# Altium project eGAN-FET-module.PrjPcb
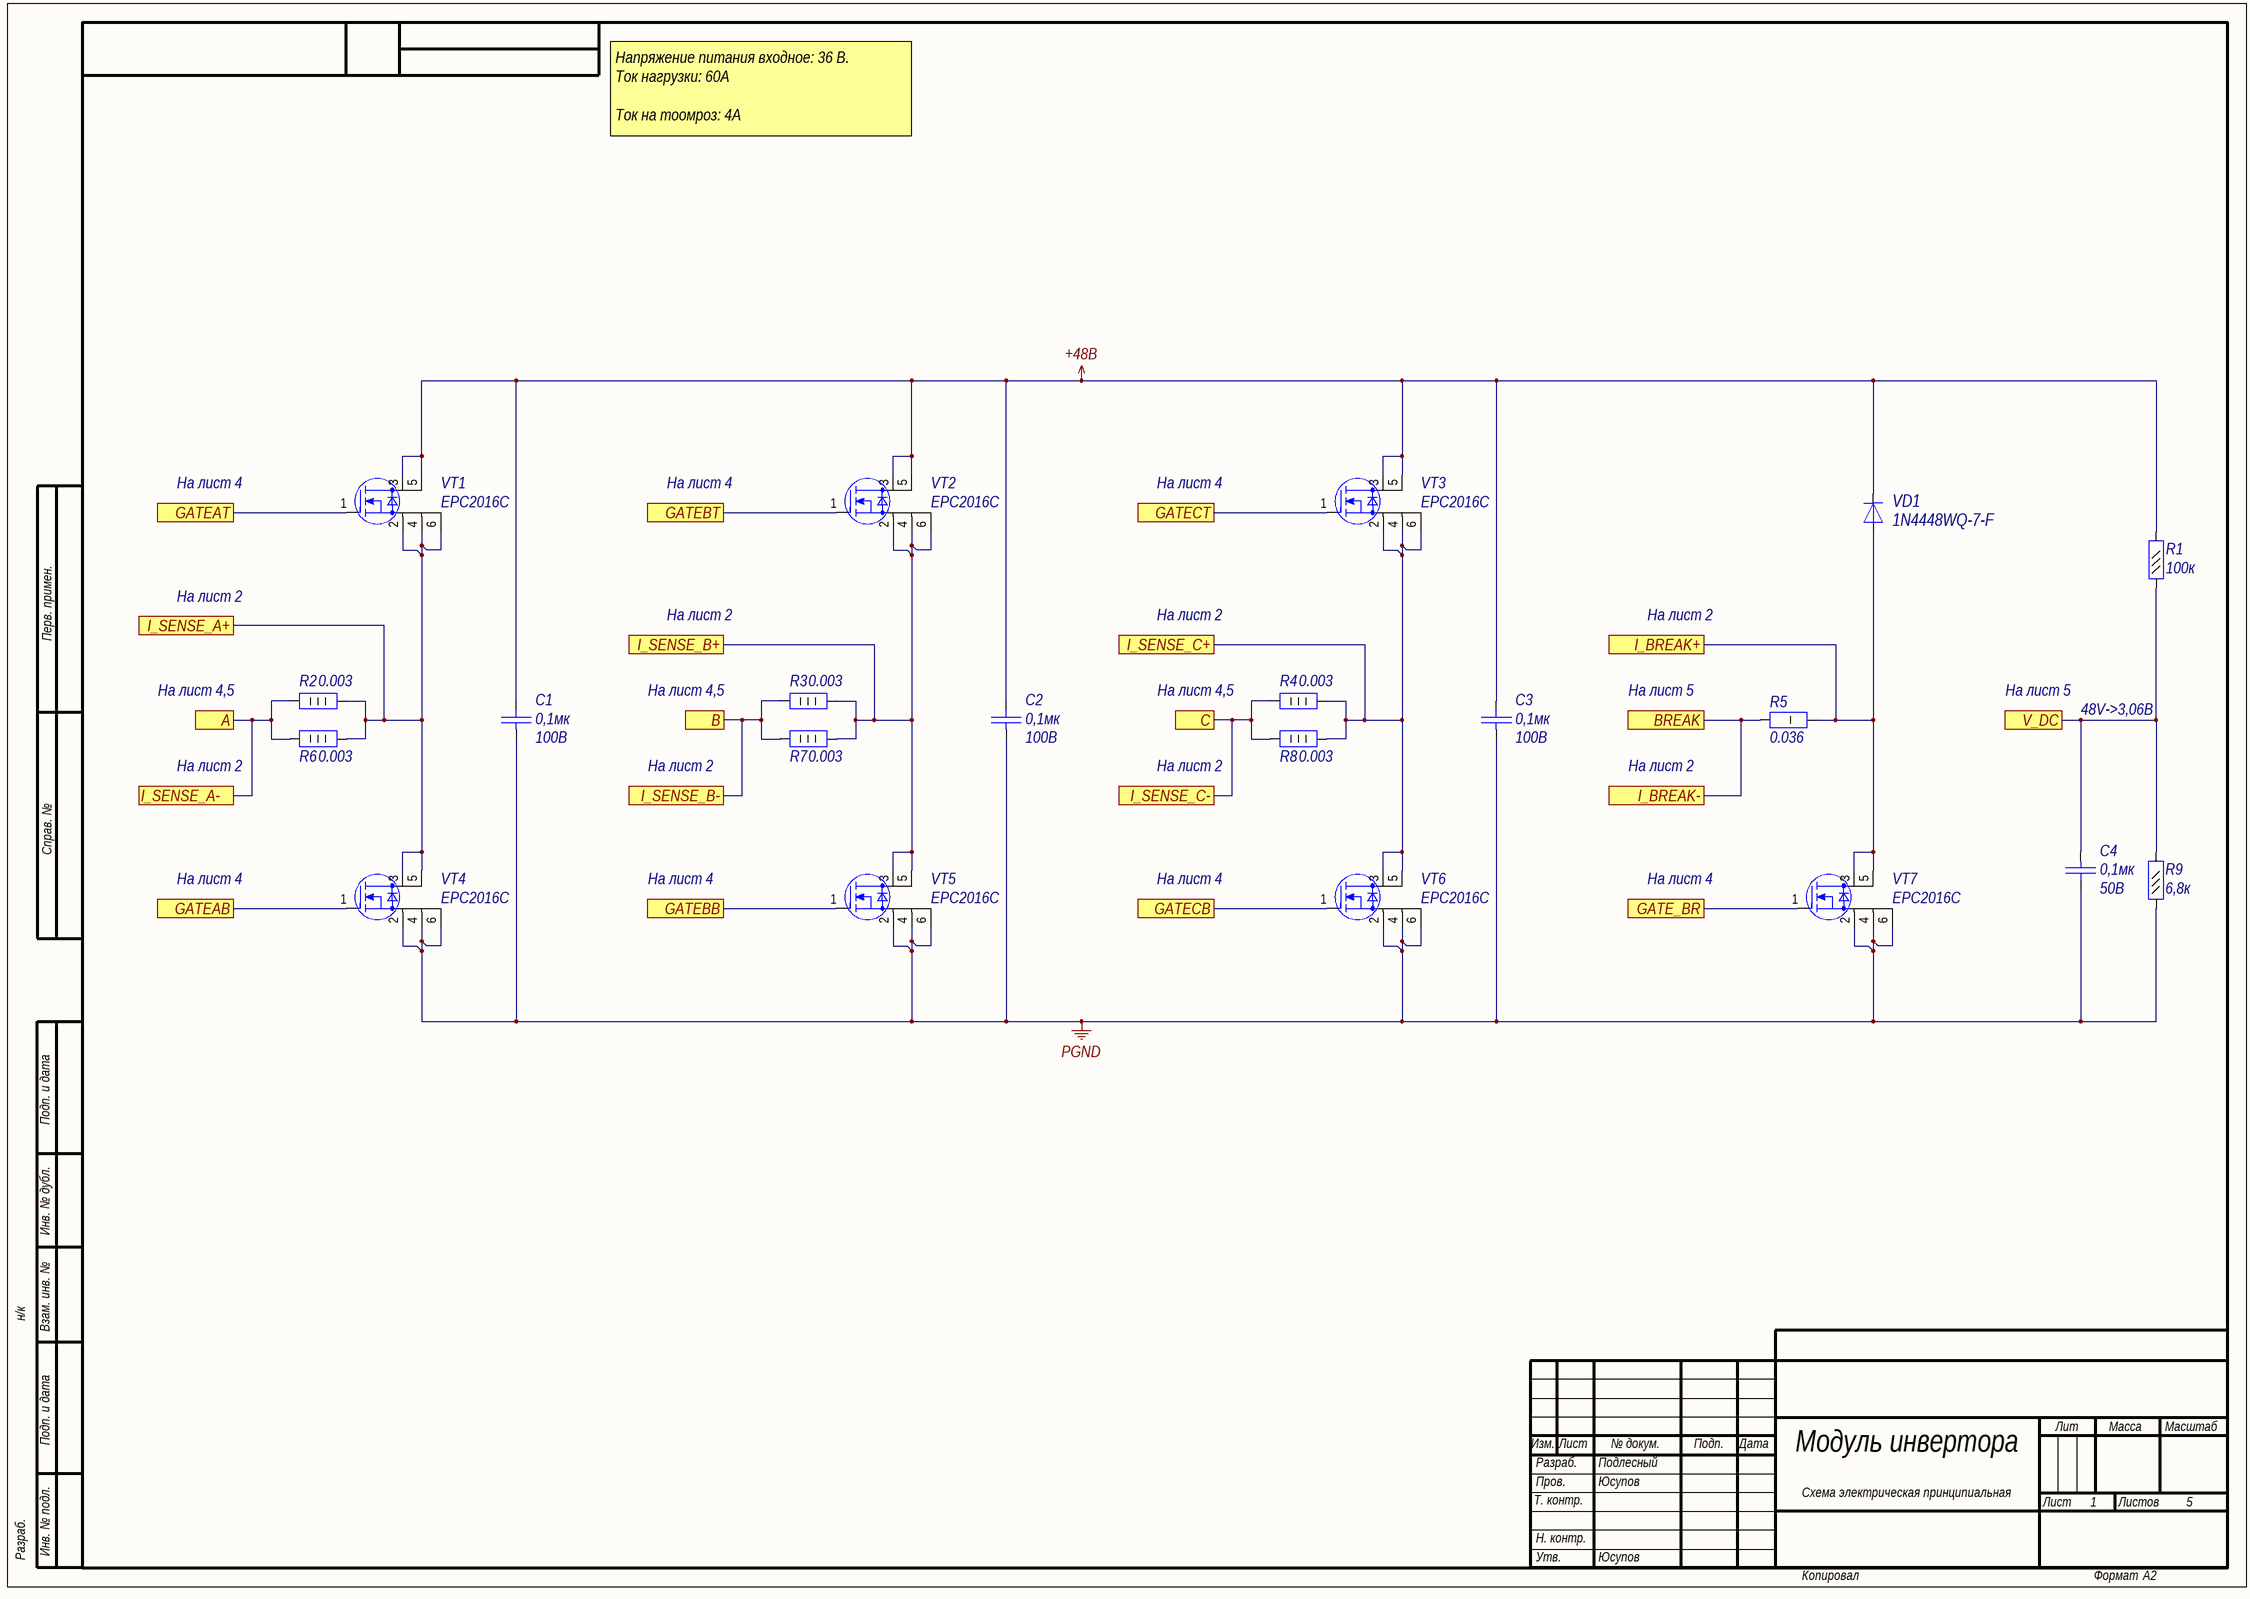
[diagram p0: eGAN-FET-module_Bridge.SchDoc]
5 sheets, 138 parts. Net scope: flat (ports and power ports of the same name join across sheets).
Board file: eGAN-FET-module.PcbDoc
Sheets:
  eGAN-FET-module_Bridge.SchDoc
  eGAN-FET-module_Amplifier.SchDoc
  eGAN-FET-module_Logic.SchDoc
  eGAN-FET-module_Driver.SchDoc
  eGAN-FET-module_Connectors.SchDoc

## Sheet eGAN-FET-module_Bridge.SchDoc: Модуль инвертора
size 594 x 420 mm; ApprovedBy: Юсупов; CheckedBy: Юсупов; DrawnBy: Подлесный; SheetNumber: 1; SheetTotal: 5; Format: A2; DocumentType: Схема электрическая принципиальная

### Parts
C1  Voltage: 100В  [C1206]  (hidden comment: 0,1мк)
C2  Voltage: 100В  [C1206]  (hidden comment: 0,1мк)
C3  Voltage: 100В  [C1206]  (hidden comment: 0,1мк)
C4  value 0,1мк  Voltage: 50В  [C0402]  (hidden comment: Capacitor)
R1  value 100к  [R0402]  (hidden comment: Resistor_0,062Вт)
R2  0.003  [R2512]
R3  0.003  [R2512]
R4  0.003  [R2512]
R5  0.036  [R1206]
R6  0.003  [R2512]
R7  0.003  [R2512]
R8  0.003  [R2512]
R9  6,8к  [R0402]
VD1  1N4448WQ-7-F  [SOD-123]
VT1  EPC2016C  [EPC2016C]
VT2  EPC2016C  [EPC2016C]
VT3  EPC2016C  [EPC2016C]
VT4  EPC2016C  [EPC2016C]
VT5  EPC2016C  [EPC2016C]
VT6  EPC2016C  [EPC2016C]
VT7  EPC2016C  [EPC2016C]

### Ports
A, B, BREAK, C, GATE_BR, GATEAB, GATEAT, GATEBB, GATEBT, GATECB, GATECT, I_BREAK+, I_BREAK-, I_SENSE_A+, I_SENSE_A-, I_SENSE_B+, I_SENSE_B-, I_SENSE_C+, I_SENSE_C-, V_DC

### Nets
+48B: C1.2 C2.2 C3.2 R1.2 VD1.1(K) VT1.3(D) VT1.5(D) VT2.3(D) VT2.5(D) VT3.3(D) VT3.5(D)
PGND: C1.1 C2.1 C3.1 C4.2 R9.1 VT4.2(SUBSTRATE) VT4.4(S) VT4.6(S) VT5.2(SUBSTRATE) VT5.4(S) VT5.6(S) VT6.2(SUBSTRATE) VT6.4(S) VT6.6(S) VT7.2(SUBSTRATE) VT7.4(S) VT7.6(S)
A: R2.1 R6.1 ; port A, port I_SENSE_A-
B: R3.1 R7.1 ; port B, port I_SENSE_B-
BREAK: R5.1 ; port BREAK, port I_BREAK-
C: R4.1 R8.1 ; port C, port I_SENSE_C-
GATE_BR: VT7.1(G) ; port GATE_BR
GATEAB: VT4.1(G) ; port GATEAB
GATEAT: VT1.1(G) ; port GATEAT
GATEBB: VT5.1(G) ; port GATEBB
GATEBT: VT2.1(G) ; port GATEBT
GATECB: VT6.1(G) ; port GATECB
GATECT: VT3.1(G) ; port GATECT
I_BREAK+: R5.2 VD1.2(A) VT7.3(D) VT7.5(D) ; port I_BREAK+
I_SENSE_A+: R2.2 R6.2 VT1.2(SUBSTRATE) VT1.4(S) VT1.6(S) VT4.3(D) VT4.5(D) ; port I_SENSE_A+
I_SENSE_B+: R3.2 R7.2 VT2.2(SUBSTRATE) VT2.4(S) VT2.6(S) VT5.3(D) VT5.5(D) ; port I_SENSE_B+
I_SENSE_C+: R4.2 R8.2 VT3.2(SUBSTRATE) VT3.4(S) VT3.6(S) VT6.3(D) VT6.5(D) ; port I_SENSE_C+
V_DC: C4.1 R1.1 R9.2 ; port V_DC

### Notes on the sheet
- Напряжение питания входное: 36 B.
  Ток нагрузки: 60А
  Ток на тоомроз: 4А
- На лист 4
- Перв. примен.
- На лист 2
- На лист 4,5
- (near R4) На лист 4,5
- На лист 5
- 48V->3,06B
- Справ. №
- Подп. и дата
- Инв. № дубл.
- н/к
- Взам. инв. №
- Изм.
- Лист
- № докум.
- Подп.
- Дата
- Лит
- Масса
- Масштаб
- Т. контр.
- Пров.
- Разраб.
- Листов
- Инв. № подл.
- Н. контр.
- Утв.
- Копировал
- Формат

### Library data of the parts
C1-C3 = cap286: Конденсатор; Part Name: Ceramic; Manufacture: Murata; Part Number: GRM31C5C2A104JA01L; id: cap286; TKE: NP0; Value: 0,1мк
C4 = cap277: Конденсатор; Part Name: Ceramic; Manufacture: Murata; Part Number: GRM155R71H104KE14D; id: cap277; TKE: X7R; tga: 0,10%
R1 = res318: Резистор; Manufacture: Yageo; Part Number: RC0402FR-07100KL; id: res318; Accuracy: 0.01; Part Name: Resistor; Power: 0,062Вт
R2-R4 R6-R8 = CRE2512-FZ-R003E-3: Резистор; Part Name: Current Sense Resistors; Manufacture: Bourns; id: shunt11; Accuracy: 0.01; Power: 3Вт; Part Number: CRE2512-FZ-R003E-3; Value: 0.003
R5 = ERJ-8CWFR036V: Резистор; Part Name: Current Sense Resistors; id: shunt12; Accuracy: 0.01; Power: 1Вт; Part Number: ERJ-8CWFR036V; Value: 0.036
R9 = res290: Резистор; Part Name: Resistor; Manufacture: Yageo; Part Number: RC0402FR-076K8; id: res290; Accuracy: 0.01; Power: 0,062Вт; Value: 6,8к
VD1 = diode45: Диод; Part Name: General Purpose Diodes; Manufacture: Diodes Incorporated; Max Reverse Voltage: 100B; Forward Voltage: 1,25B; Forward Current: 4A; Reverse Current: 2,5uA; Reverse Recovery time: 4ns; Capacitance: 4pF; Number: 1; id: diode45; Temp MAX: +150; Temp MIN: -65; Part Number: 1N4448WQ-7-F
VT1-VT7 = mosfert39: eGaN Enhancement Mode Power Transistor; Manufacturer: EPC; Structure: n-channel; V drain-source max: 100B; Rds: 0,016Ohm; Gate-to-source voltage: (+)6/-4; Continuous drain current: 18A; Total gate charge: 4,5nC; Pulsed drain current: 75A; id: mosfert39; Part Number: EPC2016C

## Sheet eGAN-FET-module_Amplifier.SchDoc
size 594 x 420 mm; SheetNumber: 2; Format: A2
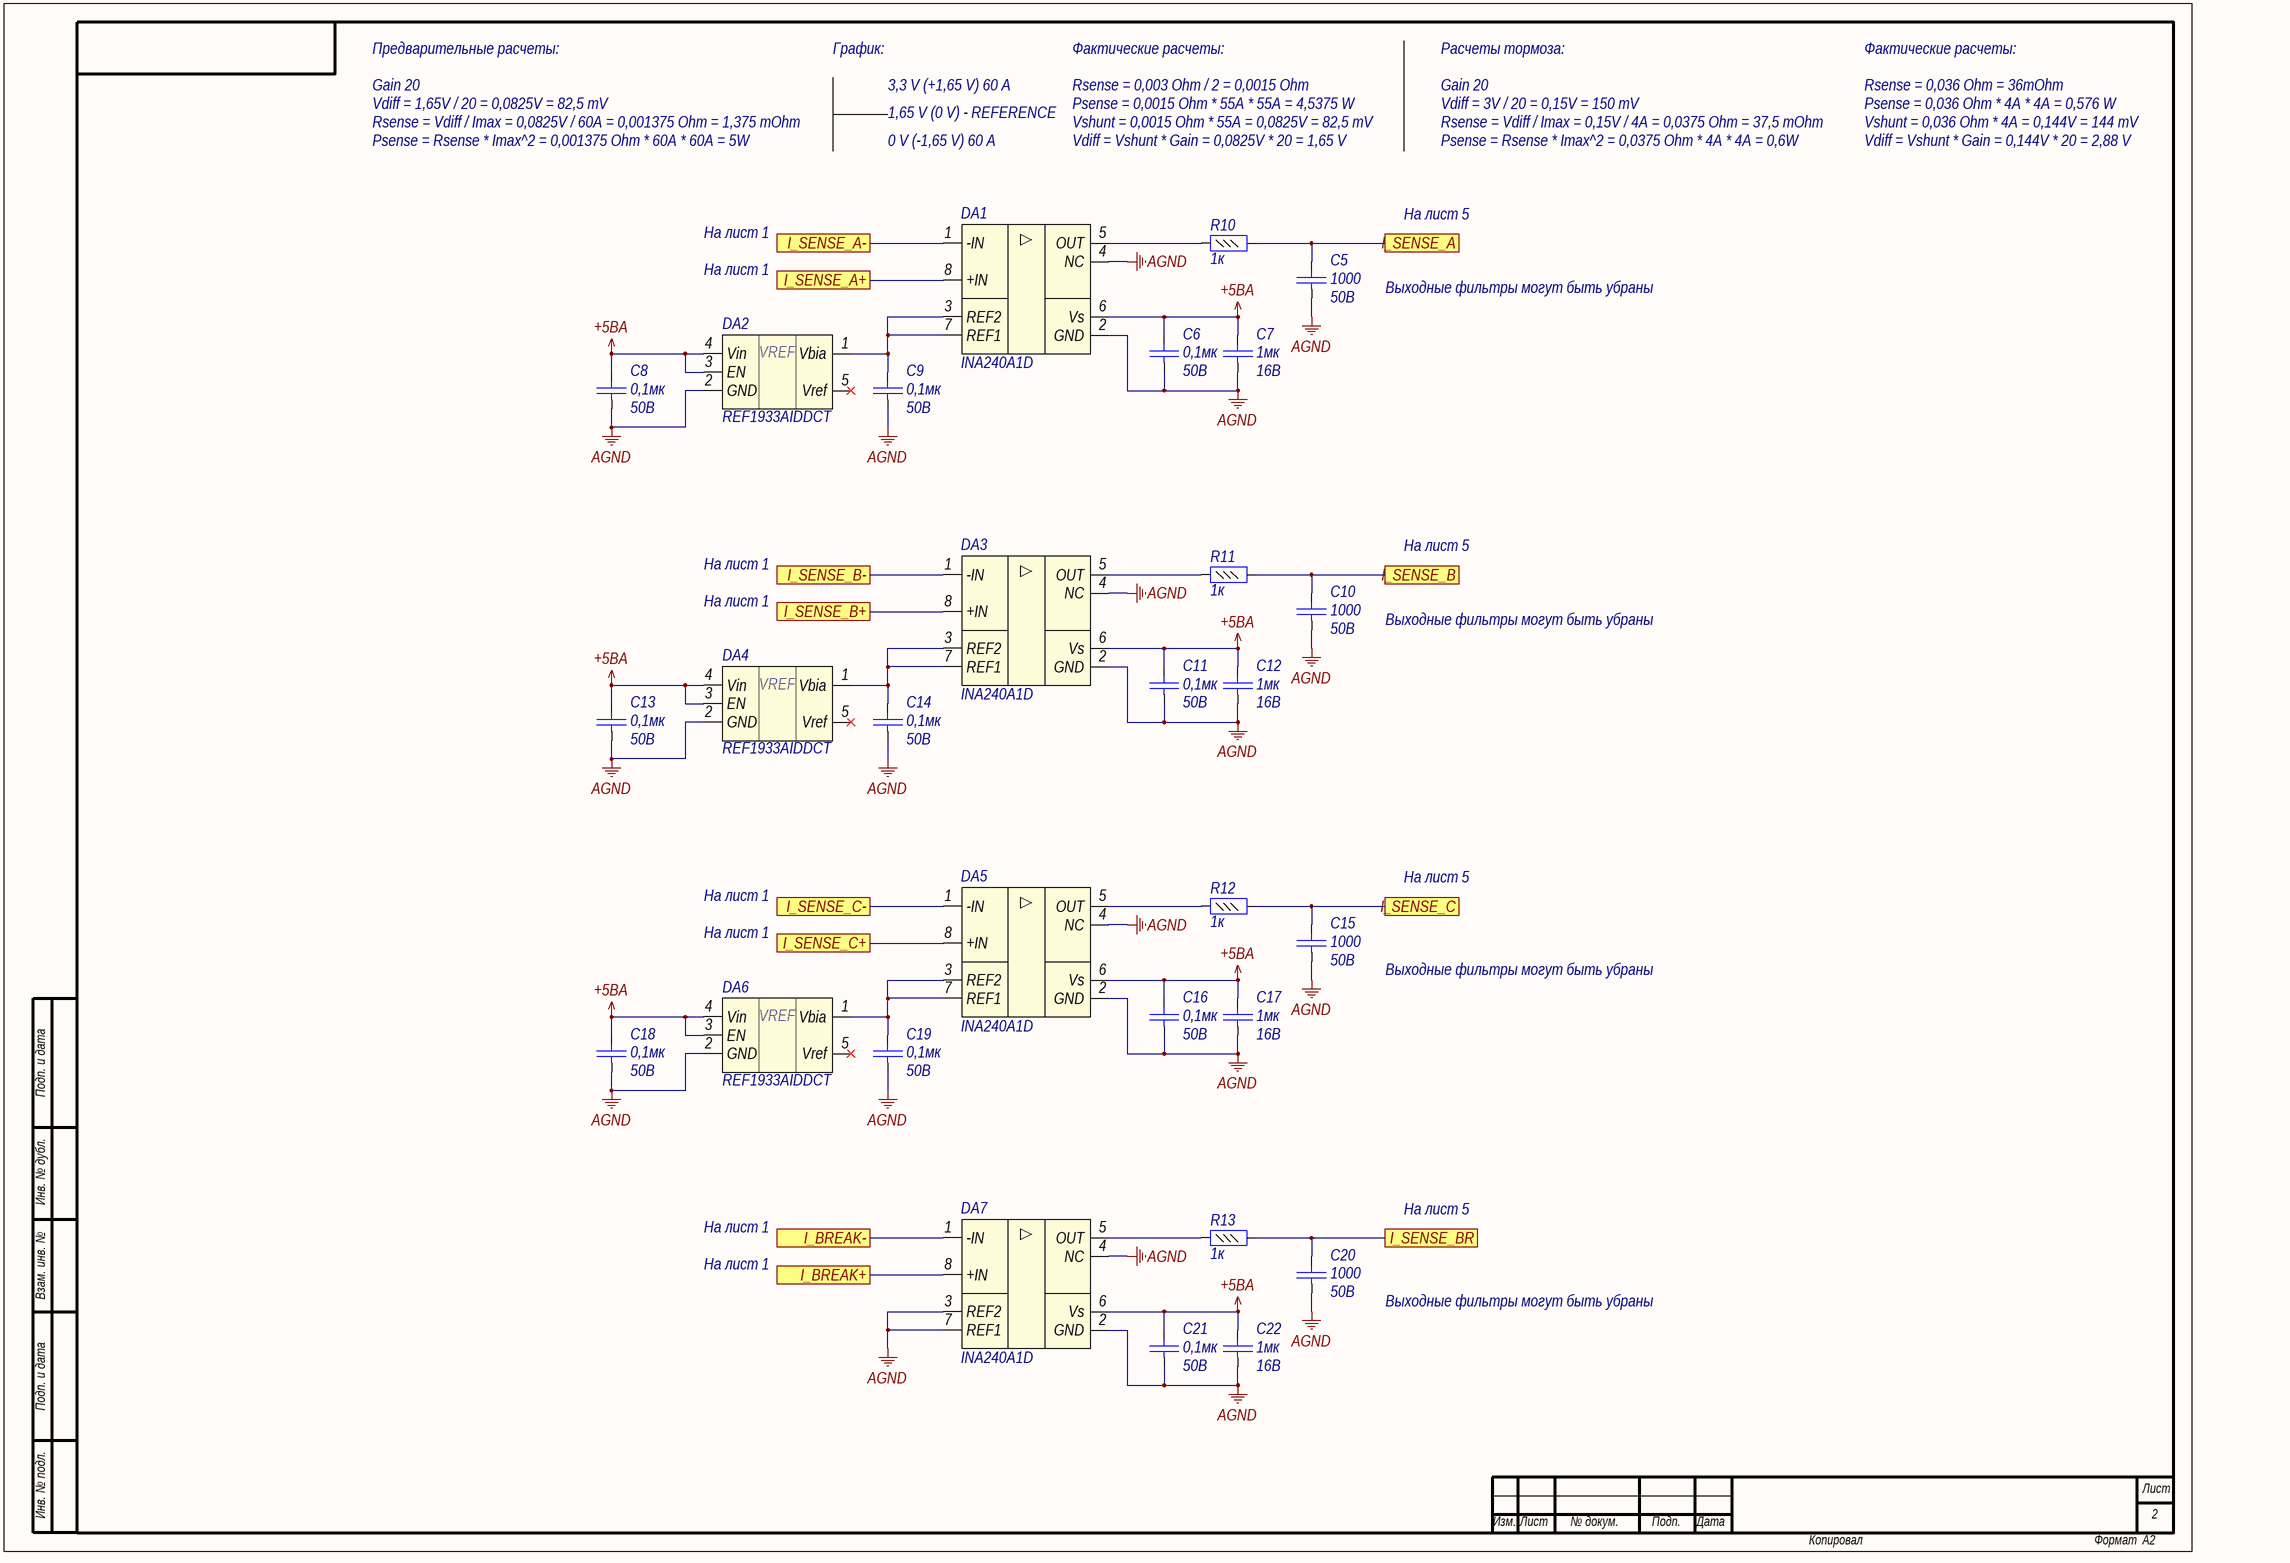
[diagram p1: eGAN-FET-module_Amplifier.SchDoc]

### Parts
C5  value 1000  Voltage: 50B  [C0402]  (hidden comment: Capacitor)
C6  value 0,1мк  Voltage: 50В  [C0402]  (hidden comment: Capacitor)
C7  Voltage: 16B  [C0402]  (hidden comment: 1мк)
C8  value 0,1мк  Voltage: 50В  [C0402]  (hidden comment: Capacitor)
C9  value 0,1мк  Voltage: 50В  [C0402]  (hidden comment: Capacitor)
C10  value 1000  Voltage: 50B  [C0402]  (hidden comment: Capacitor)
C11  value 0,1мк  Voltage: 50В  [C0402]  (hidden comment: Capacitor)
C12  Voltage: 16B  [C0402]  (hidden comment: 1мк)
C13  value 0,1мк  Voltage: 50В  [C0402]  (hidden comment: Capacitor)
C14  value 0,1мк  Voltage: 50В  [C0402]  (hidden comment: Capacitor)
C15  value 1000  Voltage: 50B  [C0402]  (hidden comment: Capacitor)
C16  value 0,1мк  Voltage: 50В  [C0402]  (hidden comment: Capacitor)
C17  Voltage: 16B  [C0402]  (hidden comment: 1мк)
C18  value 0,1мк  Voltage: 50В  [C0402]  (hidden comment: Capacitor)
C19  value 0,1мк  Voltage: 50В  [C0402]  (hidden comment: Capacitor)
C20  value 1000  Voltage: 50B  [C0402]  (hidden comment: Capacitor)
C21  value 0,1мк  Voltage: 50В  [C0402]  (hidden comment: Capacitor)
C22  Voltage: 16B  [C0402]  (hidden comment: 1мк)
DA1  INA240A1D  [SO8]
DA2  REF1933AIDDCT  [SOT23-5]
DA3  INA240A1D  [SO8]
DA4  REF1933AIDDCT  [SOT23-5]
DA5  INA240A1D  [SO8]
DA6  REF1933AIDDCT  [SOT23-5]
DA7  INA240A1D  [SO8]
R10  value 1к  [R0402]  (hidden comment: Resistor_0,062Вт)
R11  value 1к  [R0402]  (hidden comment: Resistor_0,062Вт)
R12  value 1к  [R0402]  (hidden comment: Resistor_0,062Вт)
R13  value 1к  [R0402]  (hidden comment: Resistor_0,062Вт)

### Ports
I_BREAK+, I_BREAK-, I_SENSE_A, I_SENSE_A+, I_SENSE_A-, I_SENSE_B, I_SENSE_B+, I_SENSE_B-, I_SENSE_BR, I_SENSE_C, I_SENSE_C+, I_SENSE_C-

### Nets
+5BA: C6.2 C7.2 C8.2 C11.2 C12.2 C13.2 C16.2 C17.2 C18.2 C21.2 C22.2 DA1.6(Vs) DA2.3(EN) DA2.4(Vin) DA3.6(Vs) DA4.3(EN) DA4.4(Vin) DA5.6(Vs) DA6.3(EN) DA6.4(Vin) DA7.6(Vs)
AGND: C5.1 C6.1 C7.1 C8.1 C9.1 C10.1 C11.1 C12.1 C13.1 C14.1 C15.1 C16.1 C17.1 C18.1 C19.1 C20.1 C21.1 C22.1 DA1.2(GND) DA1.4(NC) DA2.2(GND) DA3.2(GND) DA3.4(NC) DA4.2(GND) DA5.2(GND) DA5.4(NC) DA6.2(GND) DA7.2(GND) DA7.3(REF2) DA7.4(NC) DA7.7(REF1)
A: DA1.1(-IN) ; port I_SENSE_A-
B: DA3.1(-IN) ; port I_SENSE_B-
BREAK: DA7.1(-IN) ; port I_BREAK-
C: DA5.1(-IN) ; port I_SENSE_C-
I_BREAK+: DA7.8(+IN) ; port I_BREAK+
I_SENSE_A: C5.2 R10.2 ; port I_SENSE_A
I_SENSE_A+: DA1.8(+IN) ; port I_SENSE_A+
I_SENSE_B: C10.2 R11.2 ; port I_SENSE_B
I_SENSE_B+: DA3.8(+IN) ; port I_SENSE_B+
I_SENSE_BR: C20.2 R13.2 ; port I_SENSE_BR
I_SENSE_C: C15.2 R12.2 ; port I_SENSE_C
I_SENSE_C+: DA5.8(+IN) ; port I_SENSE_C+
NetC9_2: C9.2 DA1.3(REF2) DA1.7(REF1) DA2.1(Vbia)
NetC14_2: C14.2 DA3.3(REF2) DA3.7(REF1) DA4.1(Vbia)
NetC19_2: C19.2 DA5.3(REF2) DA5.7(REF1) DA6.1(Vbia)
NetDA1_5: DA1.5(OUT) R10.1
NetDA3_5: DA3.5(OUT) R11.1
NetDA5_5: DA5.5(OUT) R12.1
NetDA7_5: DA7.5(OUT) R13.1

Not connected (* = marked no-connect by the designer): DA2 5(Vref)*; DA4 5(Vref)*; DA6 5(Vref)*

### Notes on the sheet
- Предварительные расчеты:
- График:
- Фактические расчеты:
- Расчеты тормоза:
- Gain 20
- Vdiff = 1,65V / 20 = 0,0825V = 82,5 mV
- 3,3 V (+1,65 V) 60 A
- 1,65 V (0 V) - REFERENCE
- Rsense = 0,003 Ohm / 2 = 0,0015 Ohm
- Psense = 0,0015 Ohm * 55A * 55A = 4,5375 W
- Vdiff = 3V / 20 = 0,15V = 150 mV
- Rsense = 0,036 Ohm = 36mOhm
- Psense = 0,036 Ohm * 4A * 4A = 0,576 W
- Rsense = Vdiff / Imax = 0,0825V / 60A = 0,001375 Ohm = 1,375 mOhm
- Psense = Rsense * Imax^2 = 0,001375 Ohm * 60A * 60A = 5W
- 0 V (-1,65 V) 60 A
- Vshunt = 0,0015 Ohm * 55A = 0,0825V = 82,5 mV
- Vdiff = Vshunt * Gain = 0,0825V * 20 = 1,65 V
- Rsense = Vdiff / Imax = 0,15V / 4A = 0,0375 Ohm = 37,5 mOhm
- Psense = Rsense * Imax^2 = 0,0375 Ohm * 4A * 4A = 0,6W
- Vshunt = 0,036 Ohm * 4A = 0,144V = 144 mV
- Vdiff = Vshunt * Gain = 0,144V * 20 = 2,88 V
- На лист 1
- На лист 5
- Выходные фильтры могут быть убраны
- Подп. и дата
- Инв. № дубл.
- Взам. инв. №
- Инв. № подл.
- Лист
- Изм.
- № докум.
- Подп.
- Дата
- Копировал
- Формат
- (in symbol REF1933AIDDCT) VREF

### Library data of the parts
C5 C10 C15 C20 = cap28: Конденсатор; Part Name: Ceramic; Manufacture: Murata; Part Number: GRM1555C1H102J; id: cap28; TKE: NP0
C6 C8 C9 C11 C13 C14 C16 C18 C19 C21 = cap277: as C4 on sheet eGAN-FET-module_Bridge
C7 C12 C17 C22 = cap358: Конденсатор; Part Name: MLCC; Manufacture: Taiyo Yuden; Part Number: EMK105BJ105KV-F; id: cap358; TKE: X5R; tga: 0.10%; Value: 1мк; Temperature: -55°C…+85°C
DA1 DA3 DA5 DA7 = amp29: –4-V to 80-V, Bidirectional, Ultra-Precise Current Sense Amplifier With / Enhanced PWM Rejection; Manufacture: Texas Instruments; id: amp29; Supply Voltage: 2,7-5,5B; Quiescent curent: 2,6mA; Bandwidth: 400kHz; Gain: 20; Input Bias Current: 90uA; CMRR: 132dB; Channels: 1; Part Name: Bidirectional, Ultra-Precise Current Sense Amplifier; Rail-to-rail: -; PSRR: 132dB; Temperature: -55...150°C; Part Number: INA240A1D
DA2 DA4 DA6 = REF1933AIDDCT: , Dual-Output, VREF and VREF / 2 Voltage References; Part Name: Low-Drift, Low-Power, Dual-Output, Voltage References; Manufacturer: Texas Instruments; id: ref5; Voltage min stabilize: 3,3B/1,65B; Max input voltage: 5,5B; Accuracy: 0.001; Working current: 430uA; Output current: 20mA; Part Number: REF1933AIDDCT
R10-R13 = res270: Резистор; Manufacture: Yageo; Part Number: RC0402FR-071KL; id: res270; Accuracy: 0,01; Part Name: Resistor; Power: 0,062Вт

## Sheet eGAN-FET-module_Logic.SchDoc
size 594 x 420 mm; SheetNumber: 3; Format: A2
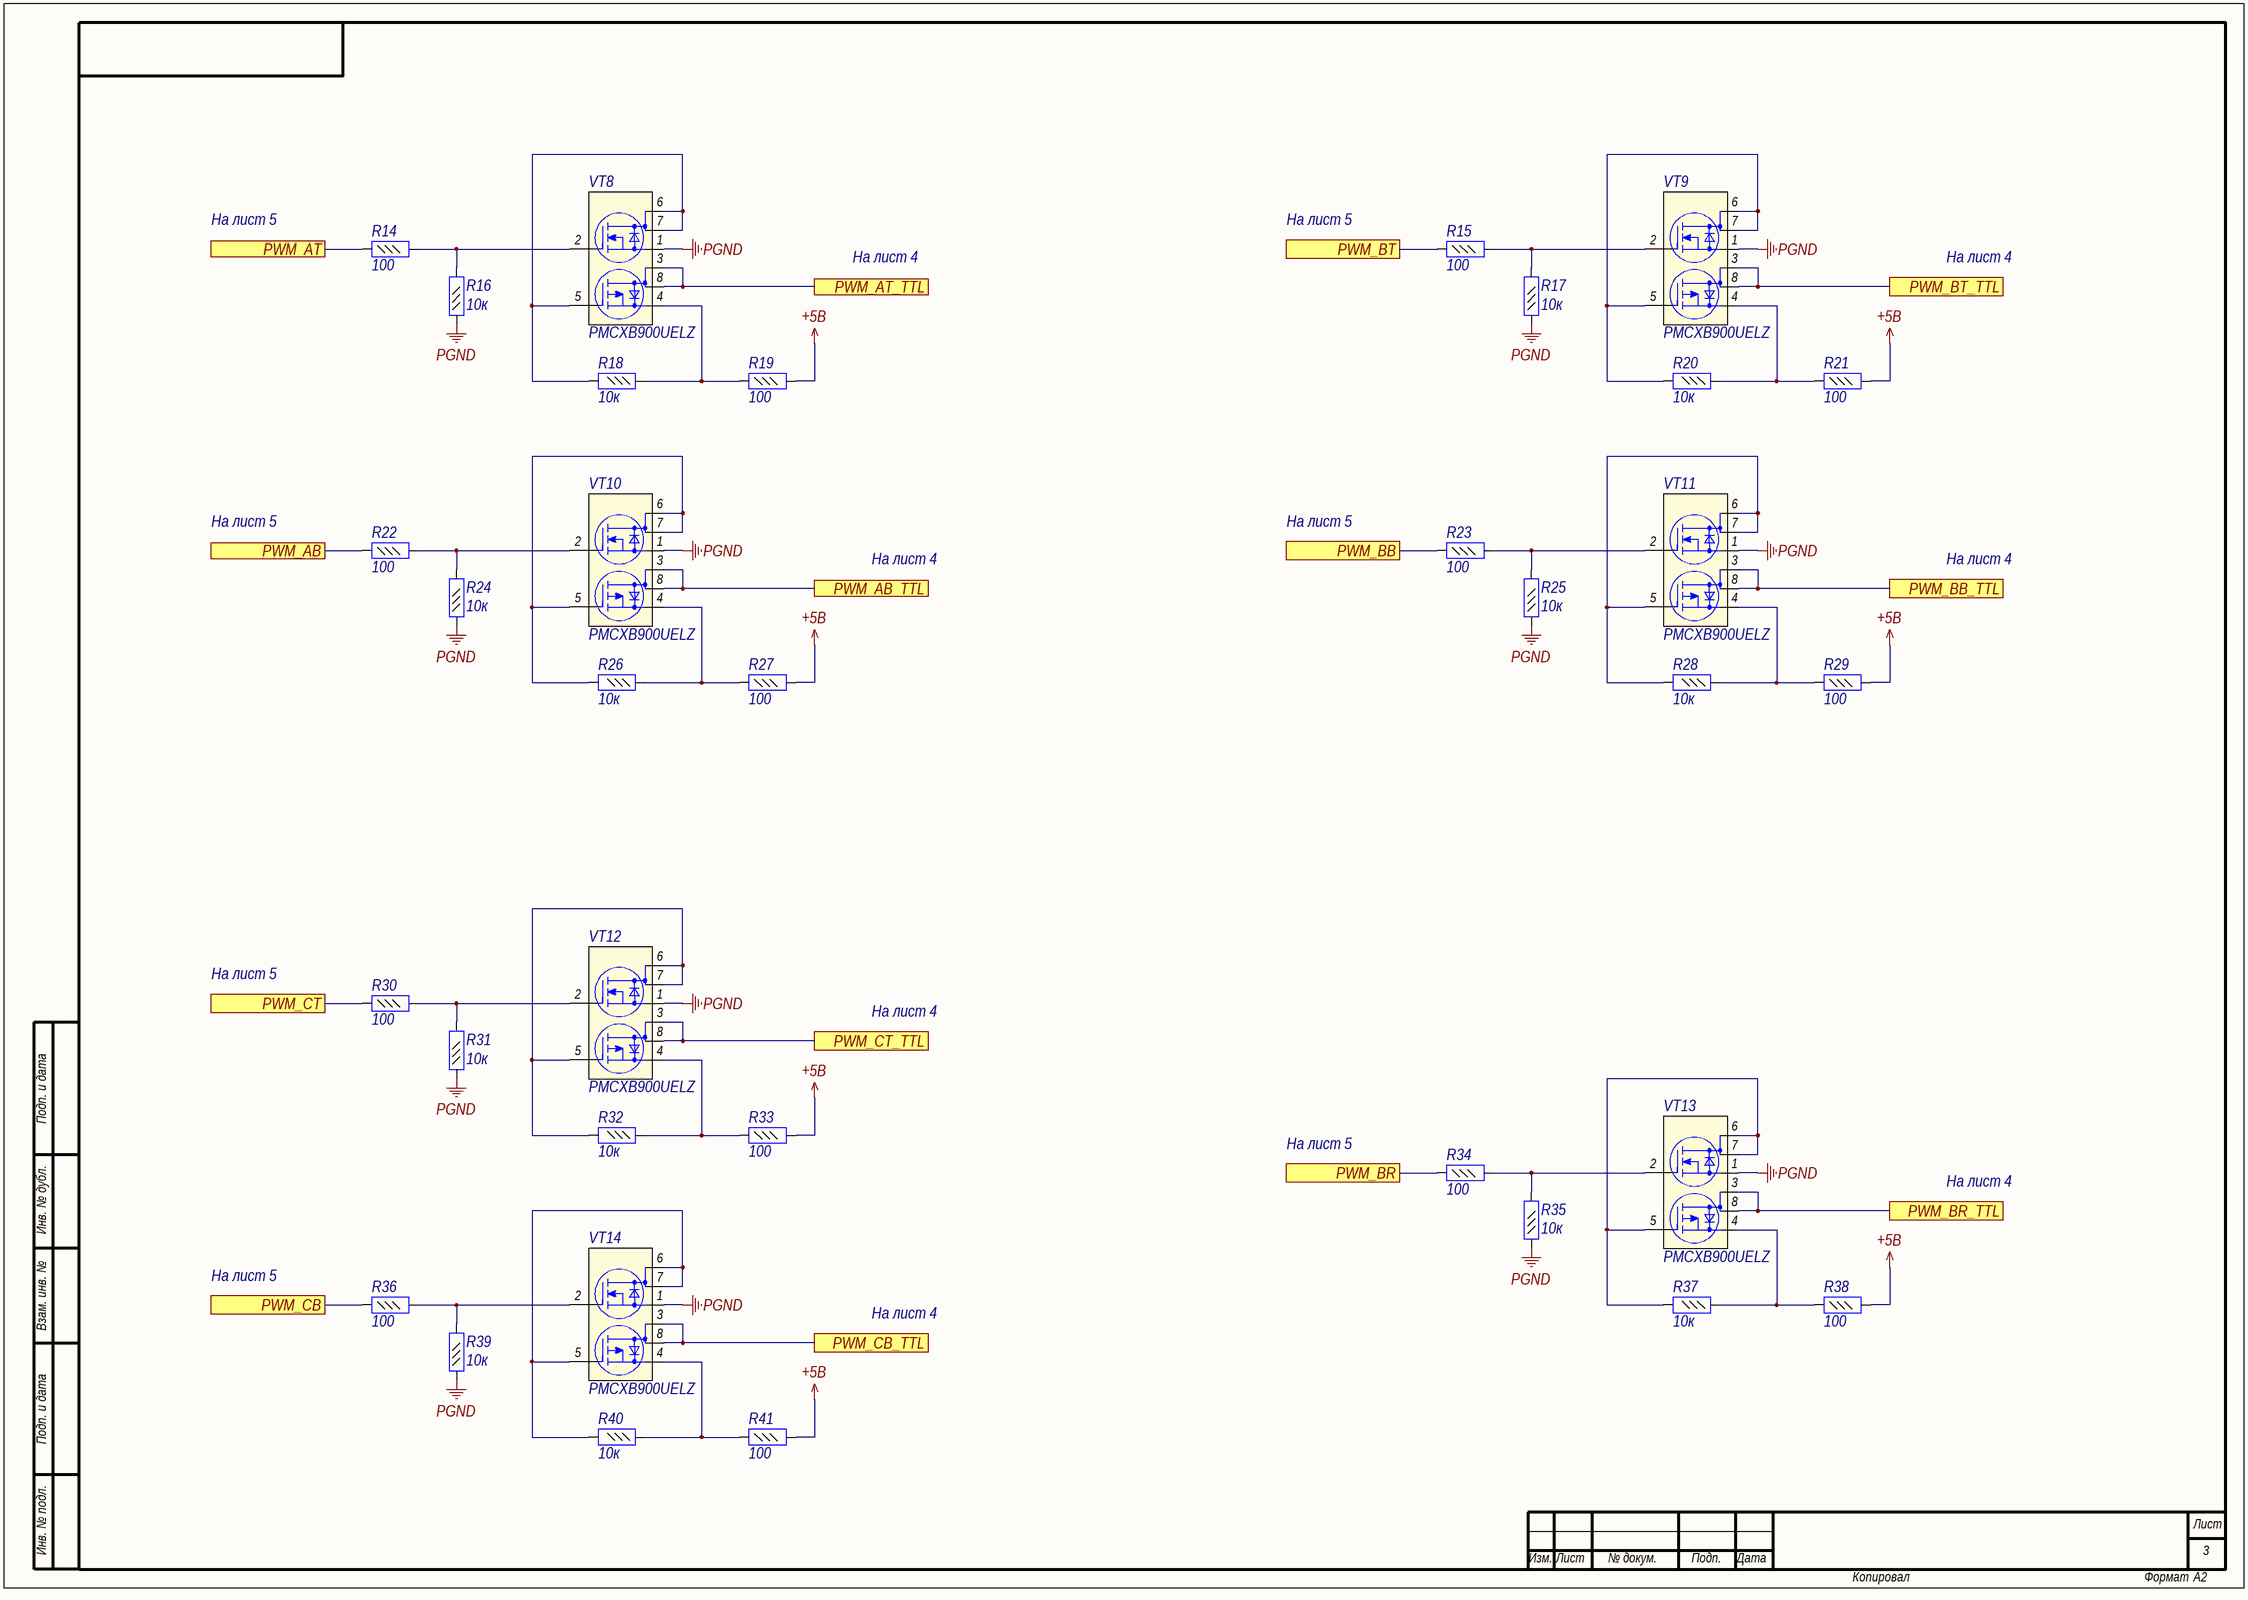
[diagram p2: eGAN-FET-module_Logic.SchDoc]

### Parts
R14  value 100  [R0402]  (hidden comment: Resistor_0,062Вт)
R15  value 100  [R0402]  (hidden comment: Resistor_0,062Вт)
R16  value 10к  [R0402]  (hidden comment: Resistor_0,062Вт)
R17  value 10к  [R0402]  (hidden comment: Resistor_0,062Вт)
R18  value 10к  [R0402]  (hidden comment: Resistor_0,062Вт)
R19  value 100  [R0402]  (hidden comment: Resistor_0,062Вт)
R20  value 10к  [R0402]  (hidden comment: Resistor_0,062Вт)
R21  value 100  [R0402]  (hidden comment: Resistor_0,062Вт)
R22  value 100  [R0402]  (hidden comment: Resistor_0,062Вт)
R23  value 100  [R0402]  (hidden comment: Resistor_0,062Вт)
R24  value 10к  [R0402]  (hidden comment: Resistor_0,062Вт)
R25  value 10к  [R0402]  (hidden comment: Resistor_0,062Вт)
R26  value 10к  [R0402]  (hidden comment: Resistor_0,062Вт)
R27  value 100  [R0402]  (hidden comment: Resistor_0,062Вт)
R28  value 10к  [R0402]  (hidden comment: Resistor_0,062Вт)
R29  value 100  [R0402]  (hidden comment: Resistor_0,062Вт)
R30  value 100  [R0402]  (hidden comment: Resistor_0,062Вт)
R31  value 10к  [R0402]  (hidden comment: Resistor_0,062Вт)
R32  value 10к  [R0402]  (hidden comment: Resistor_0,062Вт)
R33  value 100  [R0402]  (hidden comment: Resistor_0,062Вт)
R34  value 100  [R0402]  (hidden comment: Resistor_0,062Вт)
R35  value 10к  [R0402]  (hidden comment: Resistor_0,062Вт)
R36  value 100  [R0402]  (hidden comment: Resistor_0,062Вт)
R37  value 10к  [R0402]  (hidden comment: Resistor_0,062Вт)
R38  value 100  [R0402]  (hidden comment: Resistor_0,062Вт)
R39  value 10к  [R0402]  (hidden comment: Resistor_0,062Вт)
R40  value 10к  [R0402]  (hidden comment: Resistor_0,062Вт)
R41  value 100  [R0402]  (hidden comment: Resistor_0,062Вт)
VT8  PMCXB900UELZ  [SOT1216]
VT9  PMCXB900UELZ  [SOT1216]
VT10  PMCXB900UELZ  [SOT1216]
VT11  PMCXB900UELZ  [SOT1216]
VT12  PMCXB900UELZ  [SOT1216]
VT13  PMCXB900UELZ  [SOT1216]
VT14  PMCXB900UELZ  [SOT1216]

### Ports
PWM_AB, PWM_AB_TTL, PWM_AT, PWM_AT_TTL, PWM_BB, PWM_BB_TTL, PWM_BR, PWM_BR_TTL, PWM_BT, PWM_BT_TTL, PWM_CB, PWM_CB_TTL, PWM_CT, PWM_CT_TTL

### Nets
+5B: R19.2 R21.2 R27.2 R29.2 R33.2 R38.2 R41.2
PGND: R16.1 R17.1 R24.1 R25.1 R31.1 R35.1 R39.1 VT8.1(S1) VT9.1(S1) VT10.1(S1) VT11.1(S1) VT12.1(S1) VT13.1(S1) VT14.1(S1)
PWM_AB: R22.1 ; port PWM_AB
PWM_AB_TTL: VT10.3(D2) VT10.8(D2) ; port PWM_AB_TTL
PWM_AT: R14.1 ; port PWM_AT
PWM_AT_TTL: VT8.3(D2) VT8.8(D2) ; port PWM_AT_TTL
PWM_BB: R23.1 ; port PWM_BB
PWM_BB_TTL: VT11.3(D2) VT11.8(D2) ; port PWM_BB_TTL
PWM_BR: R34.1 ; port PWM_BR
PWM_BR_TTL: VT13.3(D2) VT13.8(D2) ; port PWM_BR_TTL
PWM_BT: R15.1 ; port PWM_BT
PWM_BT_TTL: VT9.3(D2) VT9.8(D2) ; port PWM_BT_TTL
PWM_CB: R36.1 ; port PWM_CB
PWM_CB_TTL: VT14.3(D2) VT14.8(D2) ; port PWM_CB_TTL
PWM_CT: R30.1 ; port PWM_CT
PWM_CT_TTL: VT12.3(D2) VT12.8(D2) ; port PWM_CT_TTL
NetR14_2: R14.2 R16.2 VT8.2(G1)
NetR15_2: R15.2 R17.2 VT9.2(G1)
NetR18_1: R18.1 R19.1 VT8.4(S2)
NetR18_2: R18.2 VT8.5(G2) VT8.6(D1) VT8.7(D1)
NetR20_1: R20.1 R21.1 VT9.4(S2)
NetR20_2: R20.2 VT9.5(G2) VT9.6(D1) VT9.7(D1)
NetR22_2: R22.2 R24.2 VT10.2(G1)
NetR23_2: R23.2 R25.2 VT11.2(G1)
NetR26_1: R26.1 R27.1 VT10.4(S2)
NetR26_2: R26.2 VT10.5(G2) VT10.6(D1) VT10.7(D1)
NetR28_1: R28.1 R29.1 VT11.4(S2)
NetR28_2: R28.2 VT11.5(G2) VT11.6(D1) VT11.7(D1)
NetR30_2: R30.2 R31.2 VT12.2(G1)
NetR32_1: R32.1 R33.1 VT12.4(S2)
NetR32_2: R32.2 VT12.5(G2) VT12.6(D1) VT12.7(D1)
NetR34_2: R34.2 R35.2 VT13.2(G1)
NetR36_2: R36.2 R39.2 VT14.2(G1)
NetR37_1: R37.1 R38.1 VT13.4(S2)
NetR37_2: R37.2 VT13.5(G2) VT13.6(D1) VT13.7(D1)
NetR40_1: R40.1 R41.1 VT14.4(S2)
NetR40_2: R40.2 VT14.5(G2) VT14.6(D1) VT14.7(D1)

### Notes on the sheet
- На лист 5
- На лист 4
- Подп. и дата
- Инв. № дубл.
- Взам. инв. №
- Инв. № подл.
- Лист
- Изм.
- № докум.
- Подп.
- Дата
- Копировал
- Формат

### Library data of the parts
R14 R15 R19 R21-R23 R27 R29 R30 R33 R34 R36 R38 R41 = res246: Резистор; Manufacture: Yageo; Part Number: RC0402FR-07100RL; id: res246; Accuracy: 0.01; Part Name: Resistor; Power: 0,062Вт
R16-R18 R20 R24-R26 R28 R31 R32 R35 R37 R39 R40 = res294: Резистор; Manufacture: Yageo; Part Number: RC0402FR-0710KL; id: res294; Accuracy: 0,01; Part Name: Resistor; Power: 0,062Вт
VT8-VT14 = mosfert37: Manufacturer: Nexperia; Structure: n-p-channel; V drain-source max: 20B; Gate-to-source voltage: (+-)8B; Continuous drain current: 0,4A; Total gate charge: 0,7nC; Pulsed drain current: 2A; Power dissipation: 0,265W; id: mosfert37; Part Number: PMCXB900UELZ

## Sheet eGAN-FET-module_Driver.SchDoc
size 594 x 420 mm; SheetNumber: 4; Format: A2
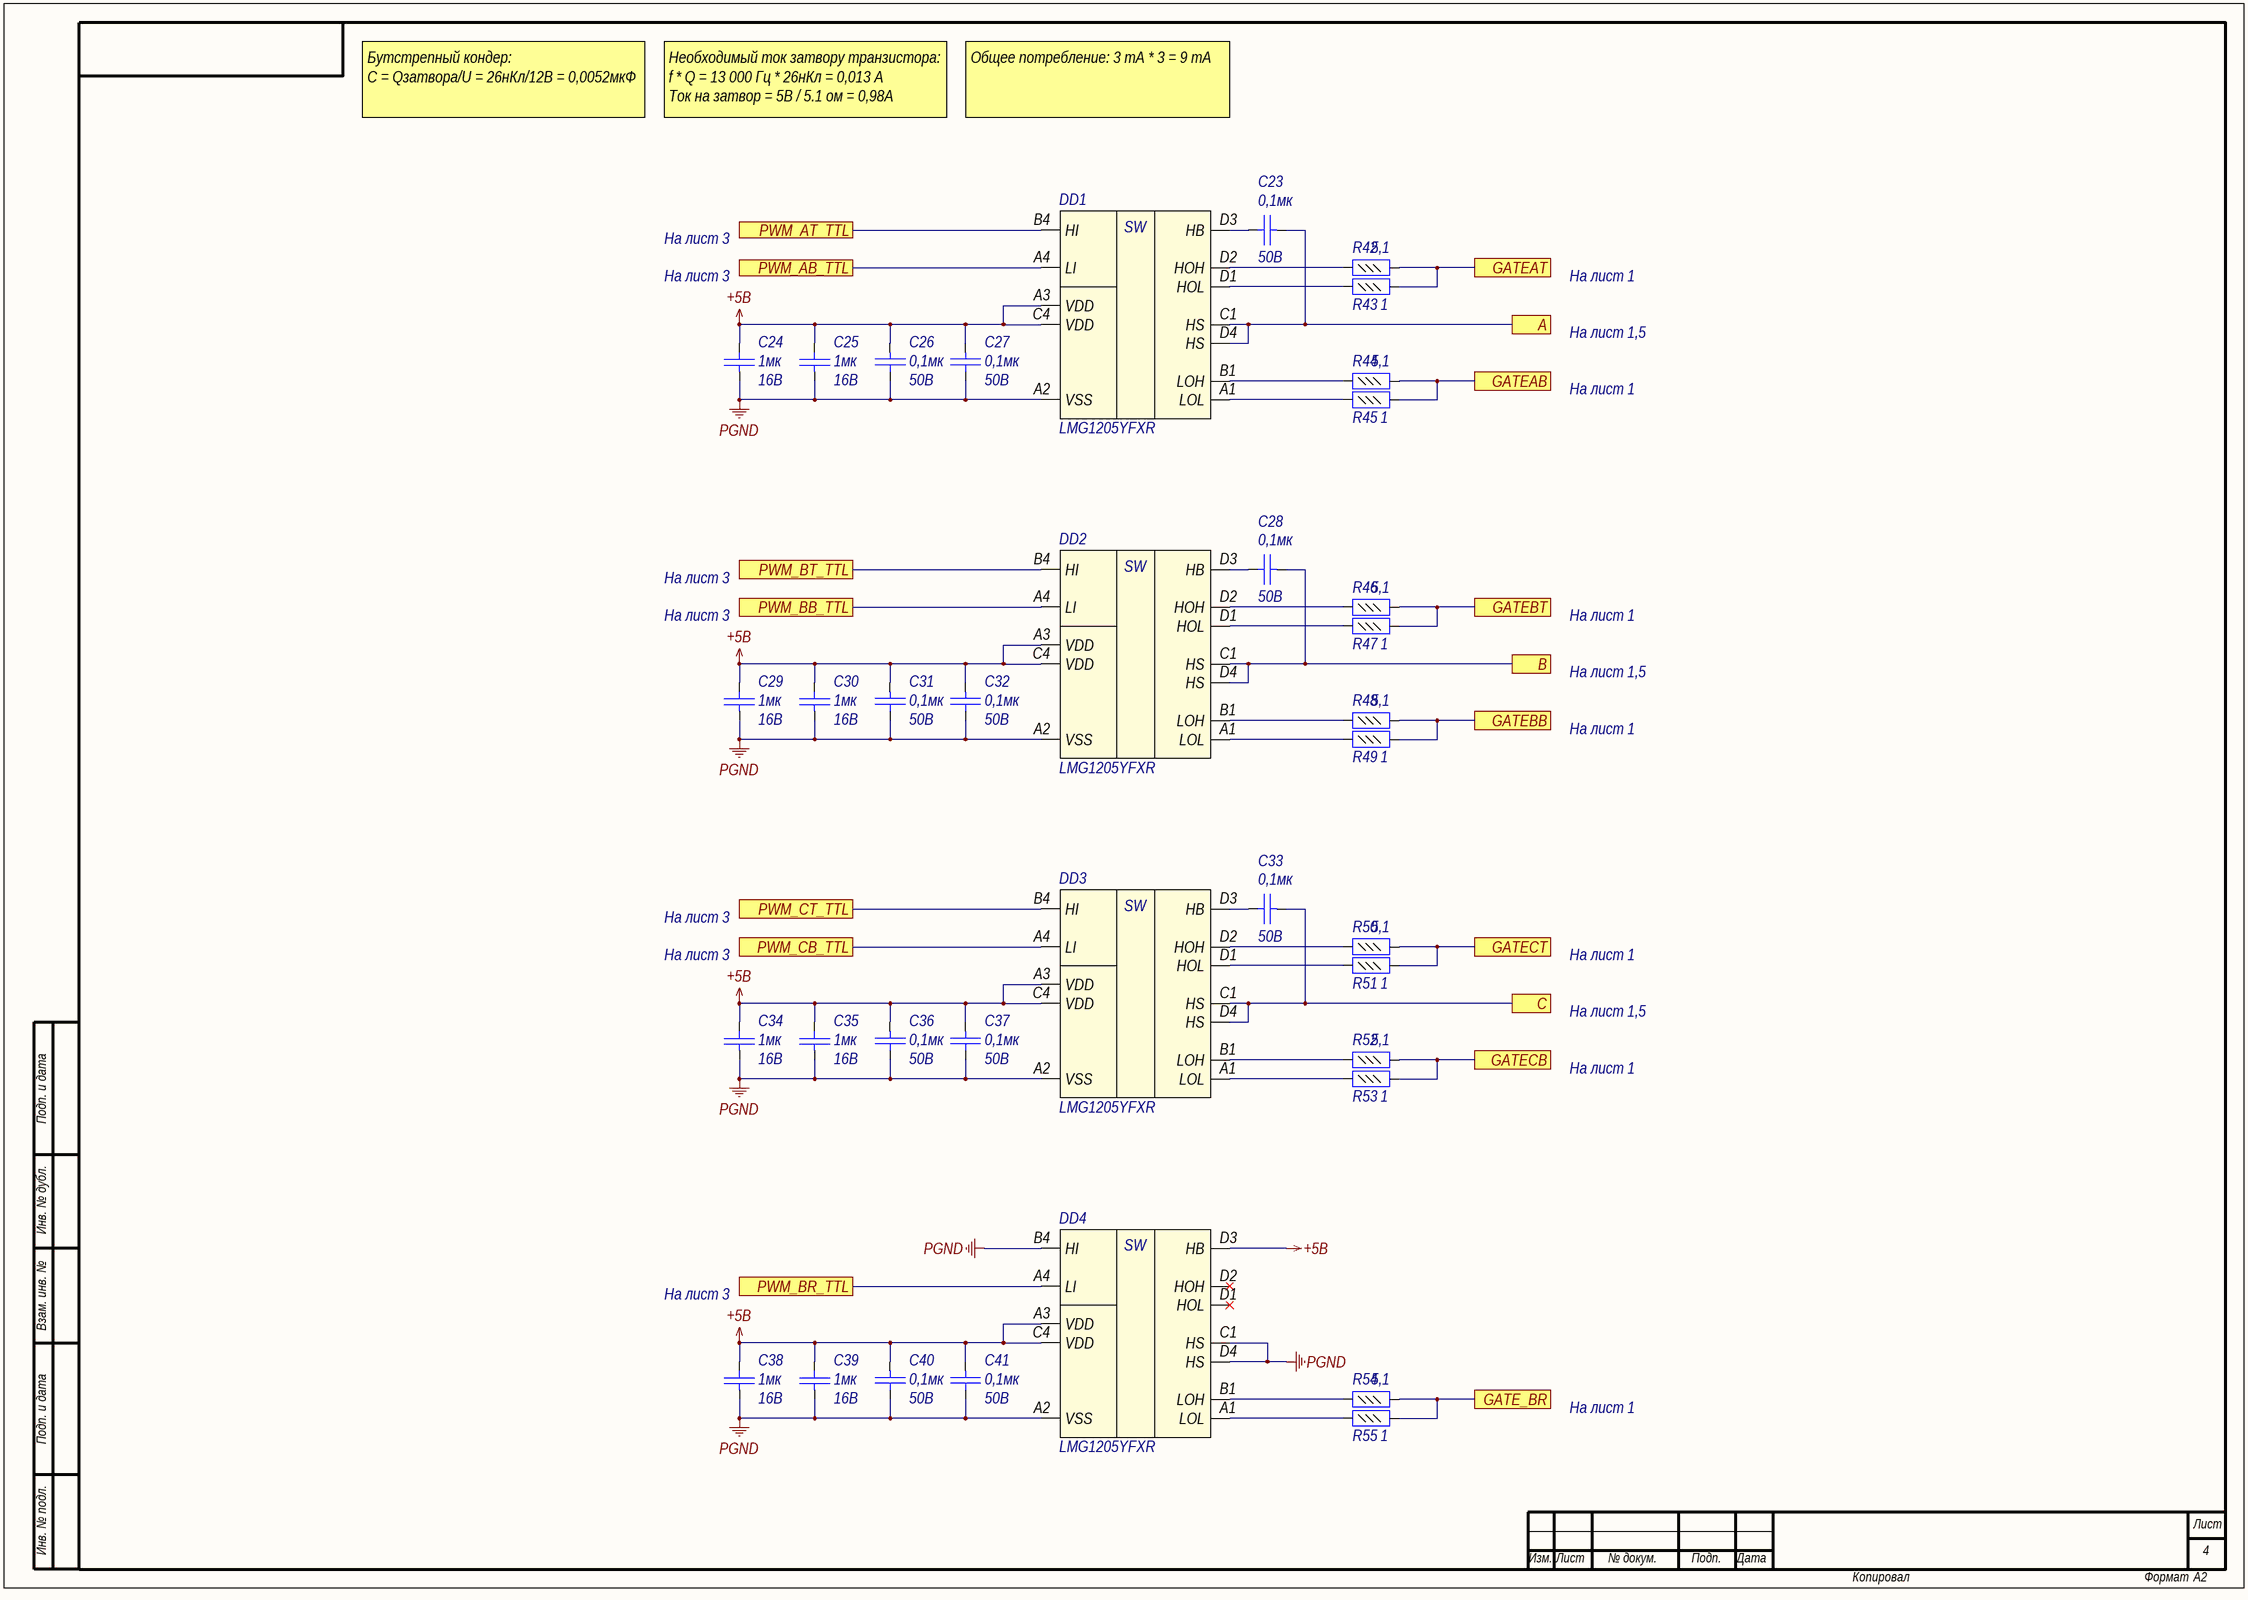
[diagram p3: eGAN-FET-module_Driver.SchDoc]

### Parts
C23  value 0,1мк  Voltage: 50В  [C0402]  (hidden comment: Capacitor)
C24  Voltage: 16B  [C0402]  (hidden comment: 1мк)
C25  Voltage: 16B  [C0402]  (hidden comment: 1мк)
C26  value 0,1мк  Voltage: 50В  [C0402]  (hidden comment: Capacitor)
C27  value 0,1мк  Voltage: 50В  [C0402]  (hidden comment: Capacitor)
C28  value 0,1мк  Voltage: 50В  [C0402]  (hidden comment: Capacitor)
C29  Voltage: 16B  [C0402]  (hidden comment: 1мк)
C30  Voltage: 16B  [C0402]  (hidden comment: 1мк)
C31  value 0,1мк  Voltage: 50В  [C0402]  (hidden comment: Capacitor)
C32  value 0,1мк  Voltage: 50В  [C0402]  (hidden comment: Capacitor)
C33  value 0,1мк  Voltage: 50В  [C0402]  (hidden comment: Capacitor)
C34  Voltage: 16B  [C0402]  (hidden comment: 1мк)
C35  Voltage: 16B  [C0402]  (hidden comment: 1мк)
C36  value 0,1мк  Voltage: 50В  [C0402]  (hidden comment: Capacitor)
C37  value 0,1мк  Voltage: 50В  [C0402]  (hidden comment: Capacitor)
C38  Voltage: 16B  [C0402]  (hidden comment: 1мк)
C39  Voltage: 16B  [C0402]  (hidden comment: 1мк)
C40  value 0,1мк  Voltage: 50В  [C0402]  (hidden comment: Capacitor)
C41  value 0,1мк  Voltage: 50В  [C0402]  (hidden comment: Capacitor)
DD1  LMG1205YFXR  [DSBGA12]
DD2  LMG1205YFXR  [DSBGA12]
DD3  LMG1205YFXR  [DSBGA12]
DD4  LMG1205YFXR  [DSBGA12]
R42  value 5,1  [R0402]  (hidden comment: Resistor_0,062Вт)
R43  value 1  [R0402]  (hidden comment: Resistor_0,062Вт)
R44  value 5,1  [R0402]  (hidden comment: Resistor_0,062Вт)
R45  value 1  [R0402]  (hidden comment: Resistor_0,062Вт)
R46  value 5,1  [R0402]  (hidden comment: Resistor_0,062Вт)
R47  value 1  [R0402]  (hidden comment: Resistor_0,062Вт)
R48  value 5,1  [R0402]  (hidden comment: Resistor_0,062Вт)
R49  value 1  [R0402]  (hidden comment: Resistor_0,062Вт)
R50  value 5,1  [R0402]  (hidden comment: Resistor_0,062Вт)
R51  value 1  [R0402]  (hidden comment: Resistor_0,062Вт)
R52  value 5,1  [R0402]  (hidden comment: Resistor_0,062Вт)
R53  value 1  [R0402]  (hidden comment: Resistor_0,062Вт)
R54  value 5,1  [R0402]  (hidden comment: Resistor_0,062Вт)
R55  value 1  [R0402]  (hidden comment: Resistor_0,062Вт)

### Ports
A, B, C, GATE_BR, GATEAB, GATEAT, GATEBB, GATEBT, GATECB, GATECT, PWM_AB_TTL, PWM_AT_TTL, PWM_BB_TTL, PWM_BR_TTL, PWM_BT_TTL, PWM_CB_TTL, PWM_CT_TTL

### Nets
+5B: C24.2 C25.2 C26.1 C27.1 C29.2 C30.2 C31.1 C32.1 C34.2 C35.2 C36.1 C37.1 C38.2 C39.2 C40.1 C41.1 DD1.A3(VDD) DD1.C4(VDD) DD2.A3(VDD) DD2.C4(VDD) DD3.A3(VDD) DD3.C4(VDD) DD4.A3(VDD) DD4.C4(VDD) DD4.D3(HB)
PGND: C24.1 C25.1 C26.2 C27.2 C29.1 C30.1 C31.2 C32.2 C34.1 C35.1 C36.2 C37.2 C38.1 C39.1 C40.2 C41.2 DD1.A2(VSS) DD2.A2(VSS) DD3.A2(VSS) DD4.A2(VSS) DD4.B4(HI) DD4.C1(HS) DD4.D4(HS)
A: C23.1 DD1.C1(HS) DD1.D4(HS) ; port A
B: C28.1 DD2.C1(HS) DD2.D4(HS) ; port B
C: C33.1 DD3.C1(HS) DD3.D4(HS) ; port C
GATE_BR: R54.2 R55.2 ; port GATE_BR
GATEAB: R44.2 R45.2 ; port GATEAB
GATEAT: R42.2 R43.2 ; port GATEAT
GATEBB: R48.2 R49.2 ; port GATEBB
GATEBT: R46.2 R47.2 ; port GATEBT
GATECB: R52.2 R53.2 ; port GATECB
GATECT: R50.2 R51.2 ; port GATECT
PWM_AB_TTL: DD1.A4(LI) ; port PWM_AB_TTL
PWM_AT_TTL: DD1.B4(HI) ; port PWM_AT_TTL
PWM_BB_TTL: DD2.A4(LI) ; port PWM_BB_TTL
PWM_BR_TTL: DD4.A4(LI) ; port PWM_BR_TTL
PWM_BT_TTL: DD2.B4(HI) ; port PWM_BT_TTL
PWM_CB_TTL: DD3.A4(LI) ; port PWM_CB_TTL
PWM_CT_TTL: DD3.B4(HI) ; port PWM_CT_TTL
NetC23_2: C23.2 DD1.D3(HB)
NetC28_2: C28.2 DD2.D3(HB)
NetC33_2: C33.2 DD3.D3(HB)
NetDD1_A1: DD1.A1(LOL) R45.1
NetDD1_B1: DD1.B1(LOH) R44.1
NetDD1_D1: DD1.D1(HOL) R43.1
NetDD1_D2: DD1.D2(HOH) R42.1
NetDD2_A1: DD2.A1(LOL) R49.1
NetDD2_B1: DD2.B1(LOH) R48.1
NetDD2_D1: DD2.D1(HOL) R47.1
NetDD2_D2: DD2.D2(HOH) R46.1
NetDD3_A1: DD3.A1(LOL) R53.1
NetDD3_B1: DD3.B1(LOH) R52.1
NetDD3_D1: DD3.D1(HOL) R51.1
NetDD3_D2: DD3.D2(HOH) R50.1
NetDD4_A1: DD4.A1(LOL) R55.1
NetDD4_B1: DD4.B1(LOH) R54.1

Not connected (* = marked no-connect by the designer): DD4 D1(HOL)* D2(HOH)*

### Notes on the sheet
- Бутстрепный кондер:
  C = Qзатвора/U = 26нКл/12В = 0,0052мкФ
- Необходимый ток затвору транзистора:
  f * Q = 13 000 Гц * 26нКл = 0,013 А
  Ток на затвор = 5В / 5.1 ом = 0,98А
- Общее потребление: 3 mA * 3 = 9 mA
- На лист 3
- На лист 1
- На лист 1,5
- Подп. и дата
- Инв. № дубл.
- Взам. инв. №
- Инв. № подл.
- Лист
- Изм.
- № докум.
- Подп.
- Дата
- Копировал
- Формат
- (in symbol driver35) SW

### Library data of the parts
C23 C26-C28 C31-C33 C36 C37 C40 C41 = cap277: as C4 on sheet eGAN-FET-module_Bridge
C24 C25 C29 C30 C34 C35 C38 C39 = cap358: as C7 on sheet eGAN-FET-module_Amplifier; Value: 1мк; Temperature: -55°C…+85°C
DD1-DD4 = driver35: 80-V, 1.2-A to 5-A, Half Bridge GaN Driver with Integrated Bootstrap Diode; Manufacture: Texas Instruments; Min Operating Supply Voltage: 4,5B; Max Operating Supply Voltage: 5,5B; Vbus: 90B; “A” OUTPUT: Noninverting; Supply Current: 3mA; Quiescent current: 0,12mA; Maximum output current: 1,2A source; 5A sink.; id: driver35; Part Name: Half Bridge GaN Driver with Integrated Bootstrap Diode; “B” OUTPUT: Noninverting; Part Number: LMG1205YFXR
R42 R44 R46 R48 R50 R52 R54 = res215: Резистор; Manufacture: Yageo; Part Number: RC0402FR-075R1L; id: res215; Accuracy: 0.01; Part Name: Resistor; Power: 0,062Вт
R43 R45 R47 R49 R51 R53 R55 = res198: Резистор; Manufacture: Yageo; Part Number: RC0402FR-071RL; id: res198; Accuracy: 0.01; Part Name: Resistor; Power: 0,062Вт

## Sheet eGAN-FET-module_Connectors.SchDoc
size 420 x 297 mm; SheetNumber: 5; Format: A3
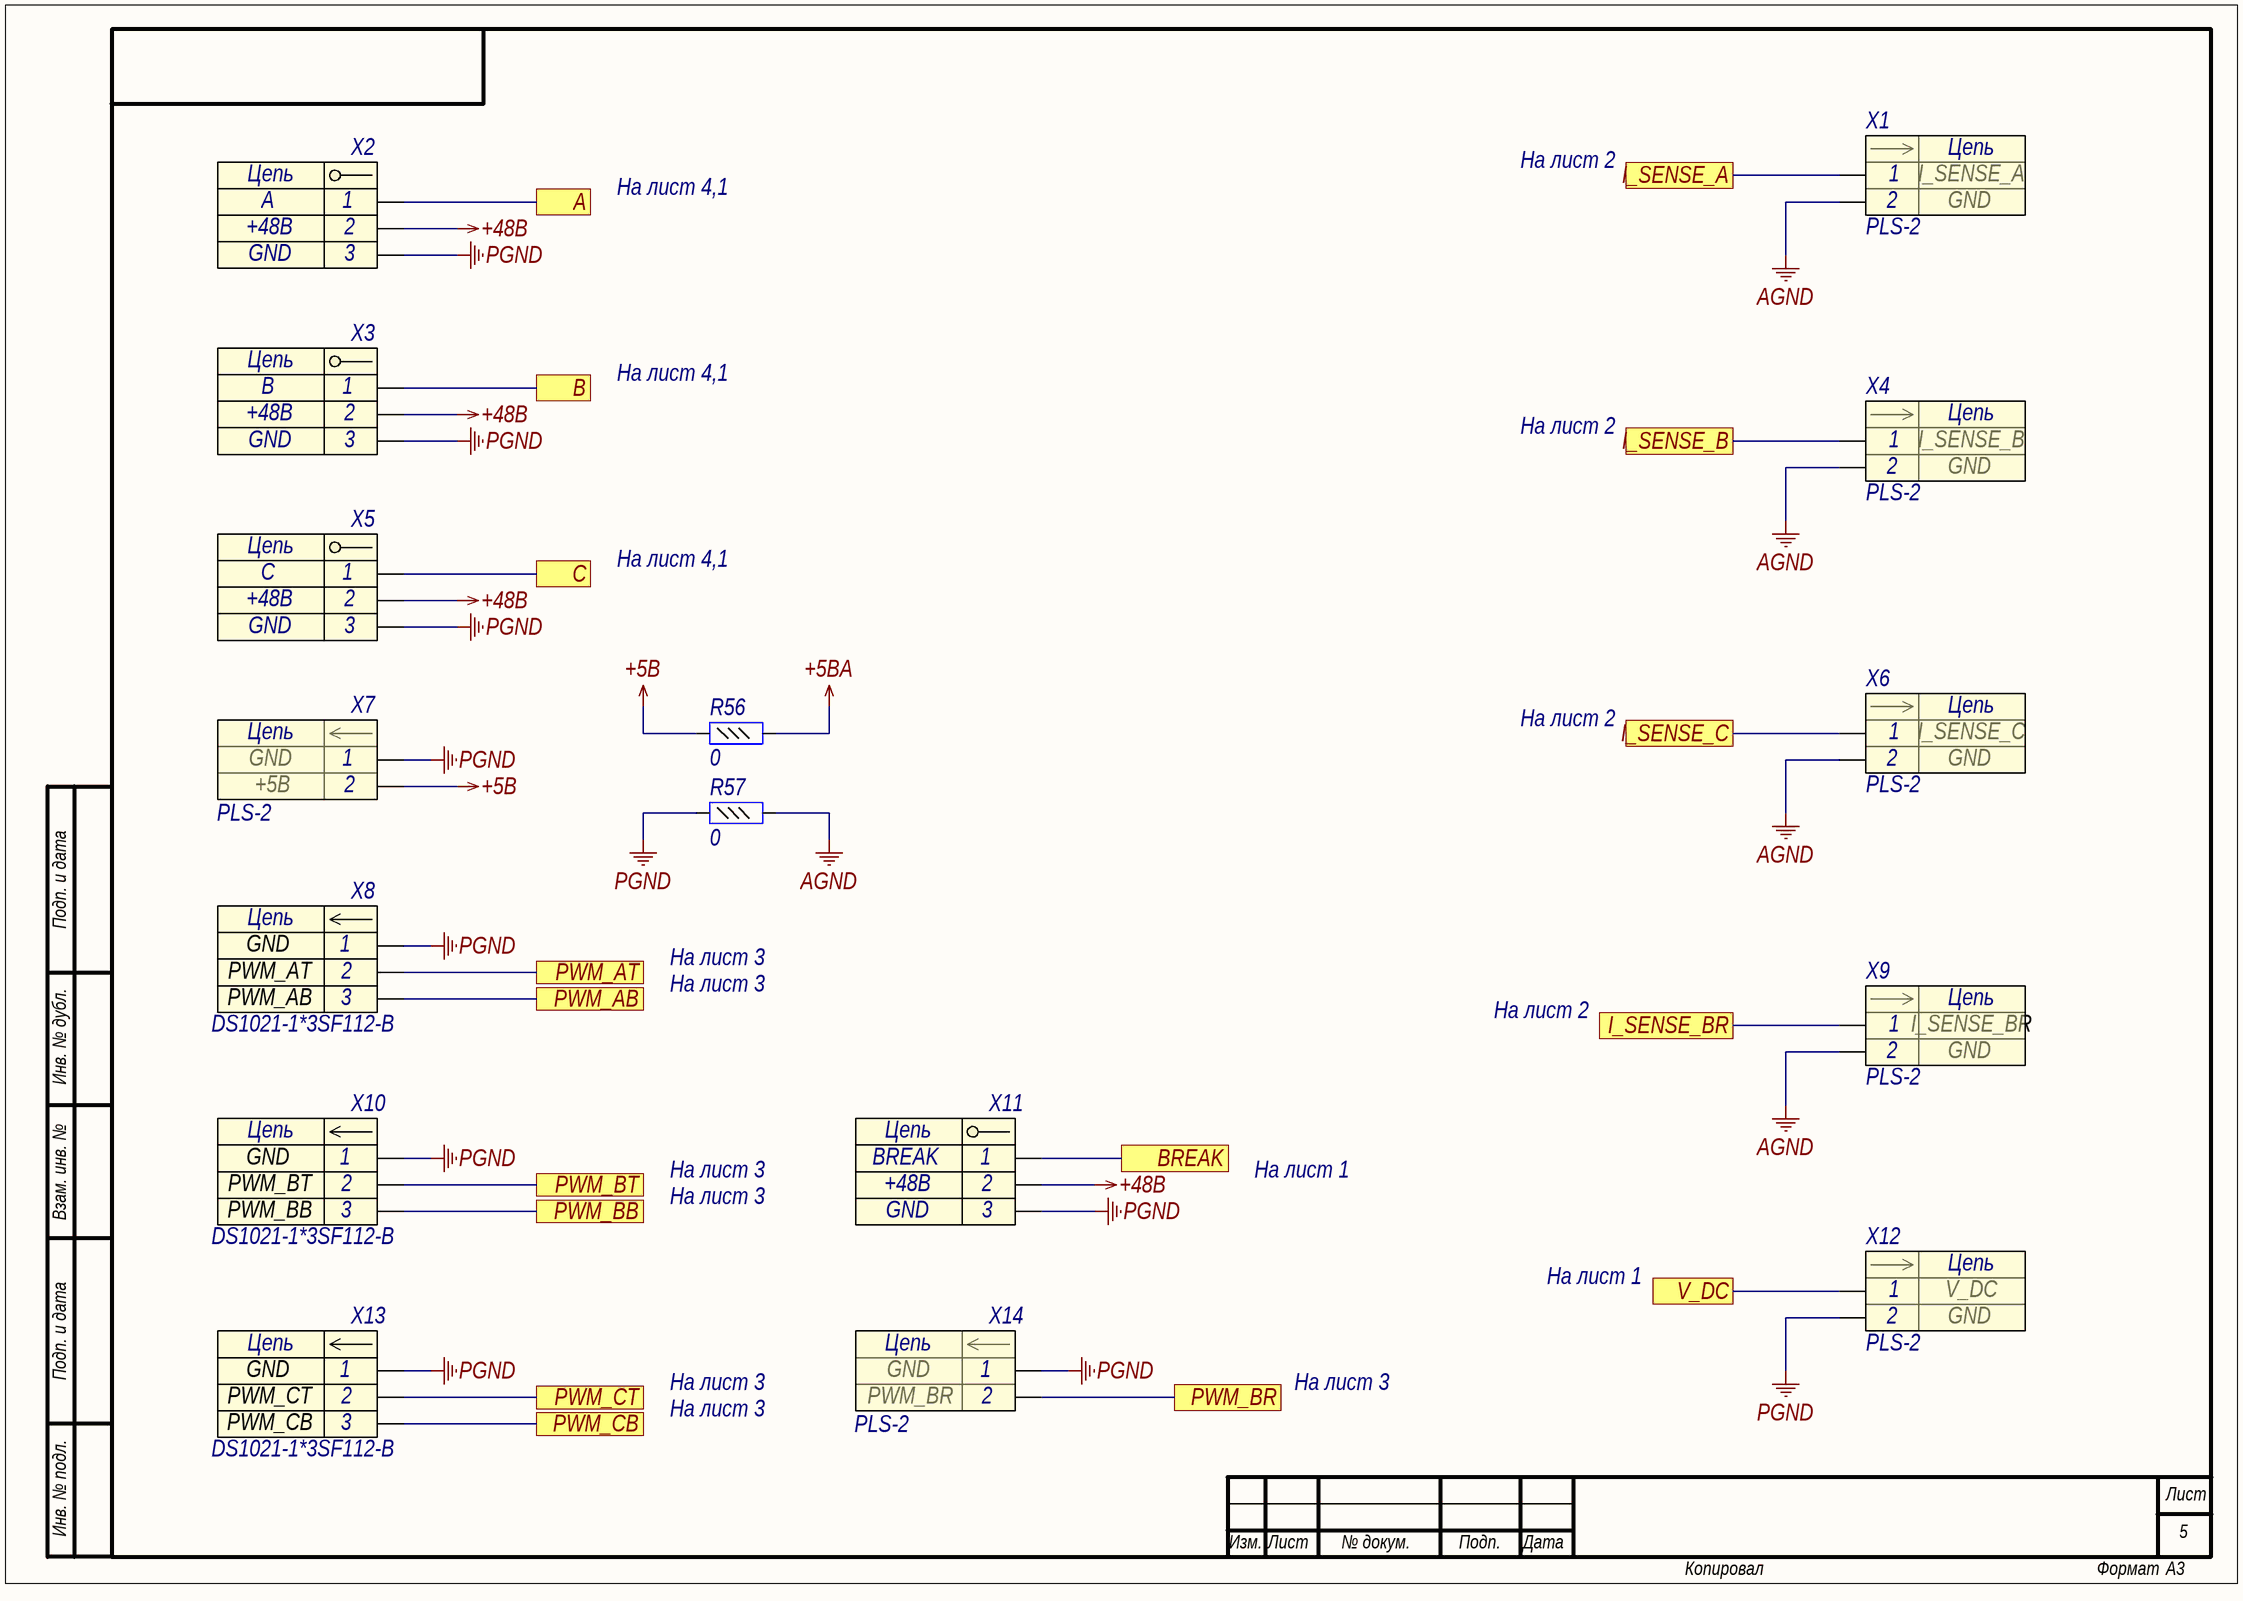
[diagram p4: eGAN-FET-module_Connectors.SchDoc]

### Parts
R56  0  [R0402]
R57  0  [R0402]
X1  (no value)  [PLS-2]
X2  (no value)  [KUBO_3]
X3  (no value)  [KUBO_3]
X4  (no value)  [PLS-2]
X5  (no value)  [KUBO_3]
X6  (no value)  [PLS-2]
X7  (no value)  [PLS-2]
X8  DS1021-1*3SF112-B  [PLS-3]
X9  (no value)  [PLS-2]
X10  DS1021-1*3SF112-B  [PLS-3]
X11  (no value)  [KUBO_3]
X12  (no value)  [PLS-2]
X13  DS1021-1*3SF112-B  [PLS-3]
X14  (no value)  [PLS-2]

### Ports
A, B, BREAK, C, I_SENSE_A, I_SENSE_B, I_SENSE_BR, I_SENSE_C, PWM_AB, PWM_AT, PWM_BB, PWM_BR, PWM_BT, PWM_CB, PWM_CT, V_DC

### Nets
+5B: R56.1 X7.2
+5BA: R56.2
+48B: X2.2 X3.2 X5.2 X11.2
AGND: R57.2 X1.2 X4.2 X6.2 X9.2
PGND: R57.1 X2.3 X3.3 X5.3 X7.1 X8.1 X10.1 X11.3 X12.2 X13.1 X14.1
A: X2.1 ; port A
B: X3.1 ; port B
BREAK: X11.1 ; port BREAK
C: X5.1 ; port C
I_SENSE_A: X1.1 ; port I_SENSE_A
I_SENSE_B: X4.1 ; port I_SENSE_B
I_SENSE_BR: X9.1 ; port I_SENSE_BR
I_SENSE_C: X6.1 ; port I_SENSE_C
PWM_AB: X8.3 ; port PWM_AB
PWM_AT: X8.2 ; port PWM_AT
PWM_BB: X10.3 ; port PWM_BB
PWM_BR: X14.2 ; port PWM_BR
PWM_BT: X10.2 ; port PWM_BT
PWM_CB: X13.3 ; port PWM_CB
PWM_CT: X13.2 ; port PWM_CT
V_DC: X12.1 ; port V_DC

### Notes on the sheet
- На лист 2
- На лист 4,1
- Подп. и дата
- На лист 3
- Инв. № дубл.
- Взам. инв. №
- На лист 1
- Инв. № подл.
- Лист
- Изм.
- № докум.
- Подп.
- Дата
- Копировал
- Формат
- (in symbol connect33) Цепь
- (in symbol connect159) Цепь
- (in symbol connect234) Цепь

### Library data of the parts
R56 R57 = res197: Резистор; Part Name: Resistor; Manufacture: Yageo; Part Number: RC0402FR-070RL; id: res197; Accuracy: 0.01; Power: 0,062Вт; Value: 0
X1 = connect159: Разъем - 2 конт. вилка; Contact_1: I_SENSE_A; Contact_2: GND; Etch: 2,54mm; Part Name: PLS-2; id: connect159
X2 = connect234: Разъем - 3 конт. клеммник; Part Name: 3 отверстия под запайку; Contact_1: A; Contact_2: +48B; Contact_3: GND; id: connect234
X3 = connect234: Разъем - 3 конт. клеммник; Part Name: 3 отверстия под запайку; Contact_1: B; Contact_2: +48B; Contact_3: GND; id: connect234
X4 = connect159: Разъем - 2 конт. вилка; Contact_1: I_SENSE_B; Contact_2: GND; Etch: 2,54mm; Part Name: PLS-2; id: connect159
X5 = connect234: Разъем - 3 конт. клеммник; Part Name: 3 отверстия под запайку; Contact_1: C; Contact_2: +48B; Contact_3: GND; id: connect234
X6 = connect159: Разъем - 2 конт. вилка; Contact_1: I_SENSE_C; Contact_2: GND; Etch: 2,54mm; Part Name: PLS-2; id: connect159
X7 = connect159: Разъем - 2 конт. вилка; Contact_1: GND; Contact_2: +5B; Etch: 2,54mm; Part Name: PLS-2; id: connect159
X8 = connect33: Разъем - 3 конт. вилка; Manufacture: Ningbo connfly electronic; Contact_1: GND; Contact_2: PWM_AT; Contact_3: PWM_AB; Etch: 2,54mm; Part Name: PLS-3; id: connect33; Part Number: DS1021-1*3SF112-B
X9 = connect159: Разъем - 2 конт. вилка; Contact_1: I_SENSE_BR; Contact_2: GND; Etch: 2,54mm; Part Name: PLS-2; id: connect159
X10 = connect33: Разъем - 3 конт. вилка; Manufacture: Ningbo connfly electronic; Contact_1: GND; Contact_2: PWM_BT; Contact_3: PWM_BB; Etch: 2,54mm; Part Name: PLS-3; id: connect33; Part Number: DS1021-1*3SF112-B
X11 = connect234: Разъем - 3 конт. клеммник; Part Name: 3 отверстия под запайку; Contact_1: BREAK; Contact_2: +48B; Contact_3: GND; id: connect234
X12 = connect159: Разъем - 2 конт. вилка; Contact_1: V_DC; Contact_2: GND; Etch: 2,54mm; Part Name: PLS-2; id: connect159
X13 = connect33: Разъем - 3 конт. вилка; Manufacture: Ningbo connfly electronic; Contact_1: GND; Contact_2: PWM_CT; Contact_3: PWM_CB; Etch: 2,54mm; Part Name: PLS-3; id: connect33; Part Number: DS1021-1*3SF112-B
X14 = connect159: Разъем - 2 конт. вилка; Contact_1: GND; Contact_2: PWM_BR; Etch: 2,54mm; Part Name: PLS-2; id: connect159

## Nets that join several sheets
+5B: eGAN-FET-module_Logic (7 pins), eGAN-FET-module_Driver (25 pins), eGAN-FET-module_Connectors (R56.1 X7.2)
+5BA: eGAN-FET-module_Amplifier (21 pins), eGAN-FET-module_Connectors (R56.2)
+48B: eGAN-FET-module_Bridge (11 pins), eGAN-FET-module_Connectors (X2.2 X3.2 X5.2 X11.2)
AGND: eGAN-FET-module_Amplifier (31 pins), eGAN-FET-module_Connectors (5 pins)
PGND: eGAN-FET-module_Bridge (17 pins), eGAN-FET-module_Logic (14 pins), eGAN-FET-module_Driver (23 pins), eGAN-FET-module_Connectors (11 pins)
A: eGAN-FET-module_Bridge (R2.1 R6.1), eGAN-FET-module_Amplifier (DA1.1), eGAN-FET-module_Driver (C23.1 DD1.C1 DD1.D4), eGAN-FET-module_Connectors (X2.1)
B: eGAN-FET-module_Bridge (R3.1 R7.1), eGAN-FET-module_Amplifier (DA3.1), eGAN-FET-module_Driver (C28.1 DD2.C1 DD2.D4), eGAN-FET-module_Connectors (X3.1)
BREAK: eGAN-FET-module_Bridge (R5.1), eGAN-FET-module_Amplifier (DA7.1), eGAN-FET-module_Connectors (X11.1)
C: eGAN-FET-module_Bridge (R4.1 R8.1), eGAN-FET-module_Amplifier (DA5.1), eGAN-FET-module_Driver (C33.1 DD3.C1 DD3.D4), eGAN-FET-module_Connectors (X5.1)
GATE_BR: eGAN-FET-module_Bridge (VT7.1), eGAN-FET-module_Driver (R54.2 R55.2)
GATEAB: eGAN-FET-module_Bridge (VT4.1), eGAN-FET-module_Driver (R44.2 R45.2)
GATEAT: eGAN-FET-module_Bridge (VT1.1), eGAN-FET-module_Driver (R42.2 R43.2)
GATEBB: eGAN-FET-module_Bridge (VT5.1), eGAN-FET-module_Driver (R48.2 R49.2)
GATEBT: eGAN-FET-module_Bridge (VT2.1), eGAN-FET-module_Driver (R46.2 R47.2)
GATECB: eGAN-FET-module_Bridge (VT6.1), eGAN-FET-module_Driver (R52.2 R53.2)
GATECT: eGAN-FET-module_Bridge (VT3.1), eGAN-FET-module_Driver (R50.2 R51.2)
I_BREAK+: eGAN-FET-module_Bridge (R5.2 VD1.2 VT7.3 VT7.5), eGAN-FET-module_Amplifier (DA7.8)
I_SENSE_A: eGAN-FET-module_Amplifier (C5.2 R10.2), eGAN-FET-module_Connectors (X1.1)
I_SENSE_A+: eGAN-FET-module_Bridge (7 pins), eGAN-FET-module_Amplifier (DA1.8)
I_SENSE_B: eGAN-FET-module_Amplifier (C10.2 R11.2), eGAN-FET-module_Connectors (X4.1)
I_SENSE_B+: eGAN-FET-module_Bridge (7 pins), eGAN-FET-module_Amplifier (DA3.8)
I_SENSE_BR: eGAN-FET-module_Amplifier (C20.2 R13.2), eGAN-FET-module_Connectors (X9.1)
I_SENSE_C: eGAN-FET-module_Amplifier (C15.2 R12.2), eGAN-FET-module_Connectors (X6.1)
I_SENSE_C+: eGAN-FET-module_Bridge (7 pins), eGAN-FET-module_Amplifier (DA5.8)
PWM_AB: eGAN-FET-module_Logic (R22.1), eGAN-FET-module_Connectors (X8.3)
PWM_AB_TTL: eGAN-FET-module_Logic (VT10.3 VT10.8), eGAN-FET-module_Driver (DD1.A4)
PWM_AT: eGAN-FET-module_Logic (R14.1), eGAN-FET-module_Connectors (X8.2)
PWM_AT_TTL: eGAN-FET-module_Logic (VT8.3 VT8.8), eGAN-FET-module_Driver (DD1.B4)
PWM_BB: eGAN-FET-module_Logic (R23.1), eGAN-FET-module_Connectors (X10.3)
PWM_BB_TTL: eGAN-FET-module_Logic (VT11.3 VT11.8), eGAN-FET-module_Driver (DD2.A4)
PWM_BR: eGAN-FET-module_Logic (R34.1), eGAN-FET-module_Connectors (X14.2)
PWM_BR_TTL: eGAN-FET-module_Logic (VT13.3 VT13.8), eGAN-FET-module_Driver (DD4.A4)
PWM_BT: eGAN-FET-module_Logic (R15.1), eGAN-FET-module_Connectors (X10.2)
PWM_BT_TTL: eGAN-FET-module_Logic (VT9.3 VT9.8), eGAN-FET-module_Driver (DD2.B4)
PWM_CB: eGAN-FET-module_Logic (R36.1), eGAN-FET-module_Connectors (X13.3)
PWM_CB_TTL: eGAN-FET-module_Logic (VT14.3 VT14.8), eGAN-FET-module_Driver (DD3.A4)
PWM_CT: eGAN-FET-module_Logic (R30.1), eGAN-FET-module_Connectors (X13.2)
PWM_CT_TTL: eGAN-FET-module_Logic (VT12.3 VT12.8), eGAN-FET-module_Driver (DD3.B4)
V_DC: eGAN-FET-module_Bridge (C4.1 R1.1 R9.2), eGAN-FET-module_Connectors (X12.1)